# EAGLE design FrontSensor_PCB_v5 (EAGLE 9.7.0)
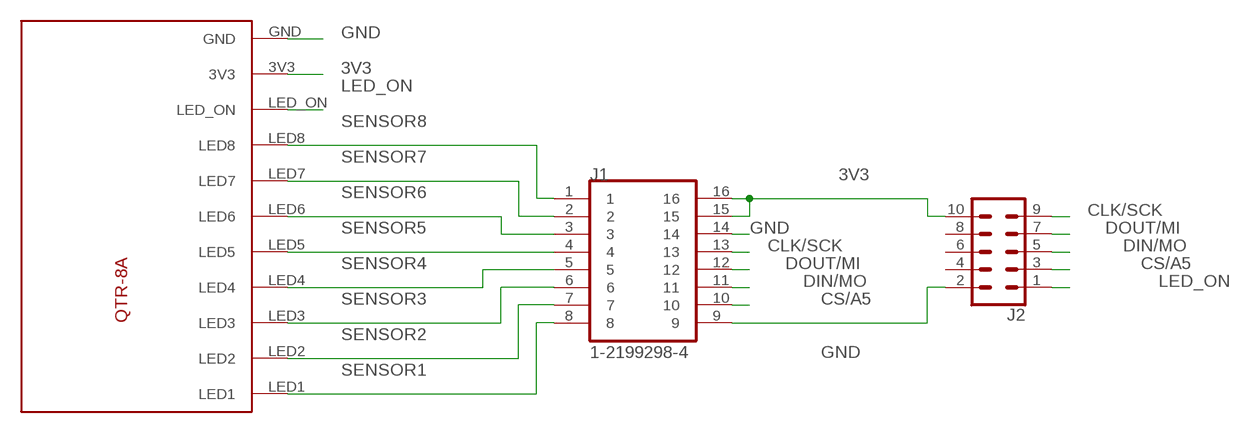
[diagram p0: schematic, sheet 1]

## Parts
J1  1-2199298-4  [TE_1-2199298-4]
J2  CONN_05X2SHD  [2X5-SHROUDED]
U$1  QTR-8A  [QTR-8A]

## Nets
3V3: J1.15 J1.16 J2.10 U$1.3V3
CLK/SCK: J1.13 J2.9
CS/A5: J1.10 J2.3
DIN/MO: J1.11 J2.5
DOUT/MI: J1.12 J2.7
GND: J1.9 J1.14 J2.2 U$1.GND
LED_ON: J2.1 U$1.LED_ON
SENSOR1: J1.8 U$1.LED1
SENSOR2: J1.7 U$1.LED2
SENSOR3: J1.6 U$1.LED3
SENSOR4: J1.5 U$1.LED4
SENSOR5: J1.4 U$1.LED5
SENSOR6: J1.3 U$1.LED6
SENSOR7: J1.2 U$1.LED7
SENSOR8: J1.1 U$1.LED8
Unconnected: J2.4 J2.6 J2.8

## Library data of the parts
J1 = 16 pin IC Socket:1-2199298-4; MANUFACTURER: TE; PARTREV: A; STANDARD: Manufacturer Recommendations
J2 = SparkFun-Connectors:CONN_05X2: Multi connection point. Often used as Generic Header-pin footprint for 0.1 inch spaced/style header connections For AVR SPI programming port, see special device with nice symbol: "AVR_SPI_PROG_5x2.dev" You can populate with any combo of single row headers, but if you'd like an exact match, check these: 2x5 AVR ICSP Male Header <https://www.sparkfun.com/products/778> (PRT-00778) 2x5 Pin Shrouded Header <https://www.sparkfun.com/products/8506> (PRT-08506) On any of the 0.1 inch spaced packages, you can populate with these: Break Away Headers - Straight <https://www.sparkfun.com/products/116> (PRT-00116) Break Away Male Headers - Right Angle <https://www.sparkfun.com/products/553> (PRT-00553) Female Headers <https://www.sparkfun.com/products/115> (PRT-00115) Break Away Headers - Machine Pin <https://www.sparkfun.com/products/117> (PRT-00117) Break Away Female Headers - Swiss Machine Pin <https://www.sparkfun.com/products/743> (PRT-00743) Special note: the shrouded connector mates well with our 5x2 ribbon cables: 2x5 Pin IDC Ribbon Cable <https://www.sparkfun.com/products/8535> (PRT-08535); PROD_ID: CONN-08671; SF_ID: PRT-08506
U$1 = QTR-8A:QTR-8A: Check availability <https://pricing.snapeda.com/parts/QTR-8A/Pololu/view-part?ref=eda>; AVAILABILITY: Not in stock; CHECK_PRICES: https://www.snapeda.com/parts/QTR-8A/Pololu/view-part/?ref=eda; DESCRIPTION: QRE1113GR series Phototransistor Sensor Evaluation Board; MF: Pololu; MP: QTR-8A; PACKAGE: None; PRICE: None; SNAPEDA_LINK: https://www.snapeda.com/parts/QTR-8A/Pololu/view-part/?ref=snap

## Board
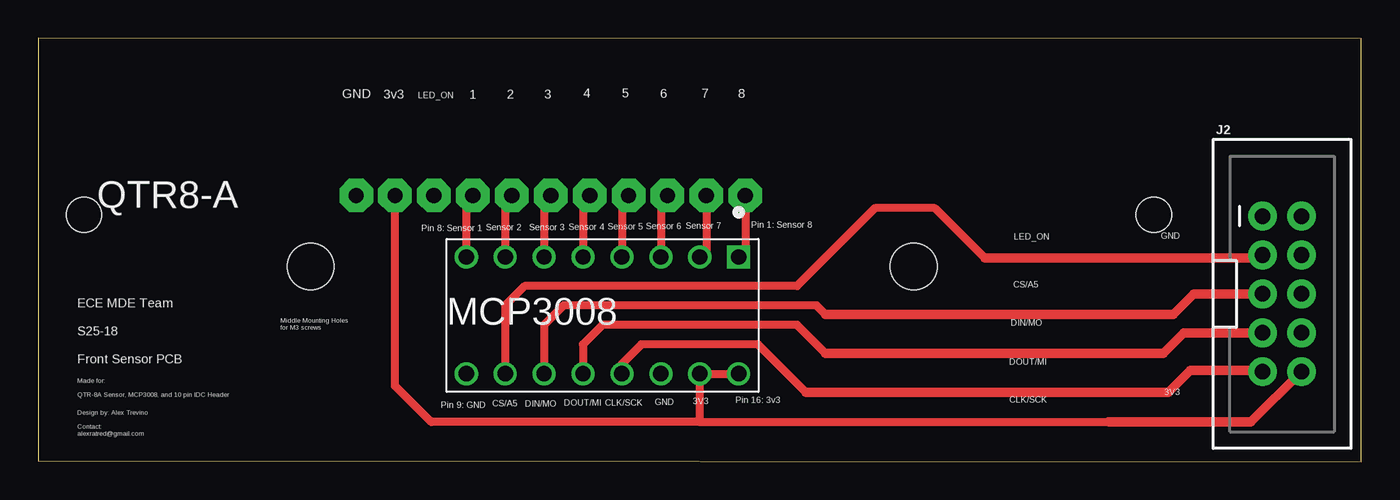
[diagram p1: board, top side]
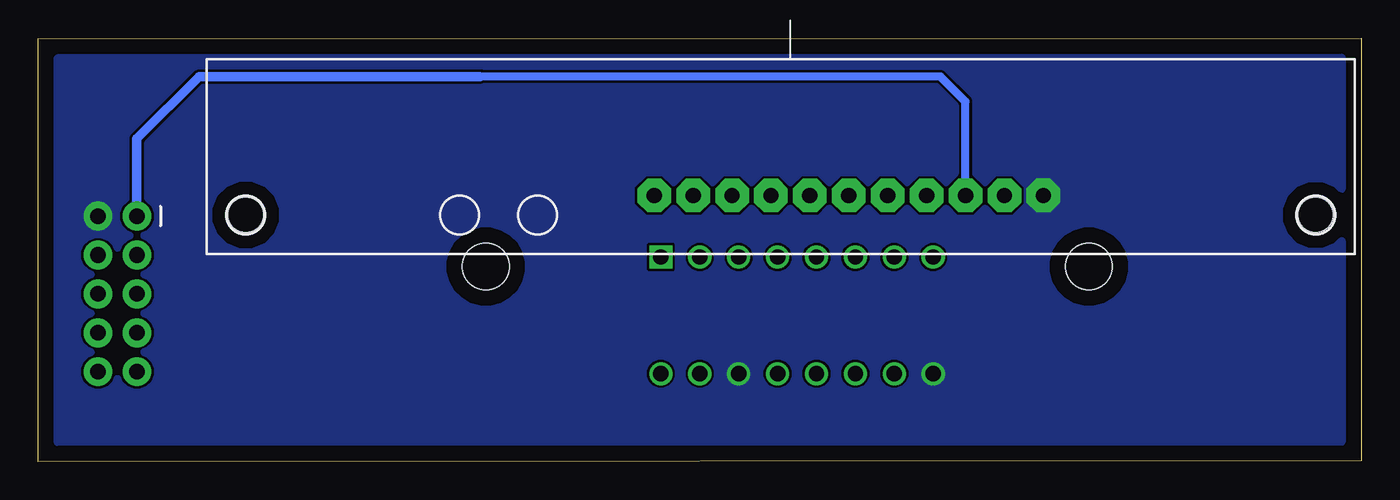
[diagram p2: board, bottom side, seen from below]

Size 86.36 x 27.65 mm. Coordinates in mm from the lower left corner, seen from the top.
Outline: 0,0.04 86.36,0 86.36,27.61 0,27.65 0,0.04
Copper layers (1*16): Top / Bottom
Stack-up Default Layer Stack: Top User Defined 0.035mm / Dielectric-1 User Defined 1.5mm / Bottom User Defined 0.035mm
Design rules: minimum copper width 6mil, minimum drill size 0.35mm, copper clearance wire_polygon to wire_polygon 6mil, copper clearance wire_polygon to pad_smd 6mil, copper clearance wire_polygon to via 6mil, copper clearance pad_smd to pad_smd 6mil, copper clearance pad_smd to via 6mil, copper clearance via to via 6mil, copper clearance smd to pad (same net) 6mil, copper clearance smd to via (same net) 6mil, copper clearance smd to smd (same net) 6mil, dimension clearance 40mil, via restrict clearance 0mil, restrict clearance 0mil, drill distance 6mil, keepout clearance 0mil
Holes 3.05 mm at 57.15,12.74 17.78,12.74

### Footprints (pad centres in the part's own frame; a part is rotated, then mirrored left to right if it is on the bottom)
TE_1-2199298-4 = drill 1 square: 1 -3.81,8.89 | drill 1: 2 -3.81,6.35; 3 -3.81,3.81; 4 -3.81,1.27; 5 -3.81,-1.27; 6 -3.81,-3.81; 7 -3.81,-6.35; 8 -3.81,-8.89; 9 3.81,-8.89; 10 3.81,-6.35; 11 3.81,-3.81; 12 3.81,-1.27; 13 3.81,1.27; 14 3.81,3.81; 15 3.81,6.35; 16 3.81,8.89
2X5-SHROUDED = drill 1.016 pad 1.88: 1 -1.27,5.08; 2 1.27,5.08; 3 -1.27,2.54; 4 1.27,2.54; 5 -1.27,0; 6 1.27,0; 7 -1.27,-2.54; 8 1.27,-2.54; 9 -1.27,-5.08; 10 1.27,-5.08
QTR-8A = drill 1 pad 2.184 octagon: 3V3 -30.48,-1.27; GND -33.02,-1.27; LED1 -25.4,-1.27; LED2 -22.86,-1.27; LED3 -20.32,-1.27; LED4 -17.78,-1.27; LED5 -15.24,-1.27; LED6 -12.7,-1.27; LED7 -10.16,-1.27; LED8 -7.62,-1.27; LED_ON -27.94,-1.27 | hole 2.286: -50.8,0; 19.05,0

### Placement (x,y rotation side)
J1  36.83,9.55 270 top
J2  81.19,10.95 0 top
U$1  53.77,16.11 180 bottom

### Tracks (layer width: path | path; a pad name or v marks a point on that pad's centre or on a via)
3V3
  Top 0.508: 43.18,2.58 69.85,2.58 | 43.18,2.58 J1.15 J1.16 | 43.18,2.58 25.65,2.58 23.29,4.94 U$1.3V3
  Top 0.61: 69.85,2.58 79.17,2.58 J2.10
CLK/SCK
  Top 0.508: 50.11,4.54 46.99,7.66 39.37,7.66 38.1,6.39 J1.13
  Top 0.61: 50.11,4.54 73.78,4.54 75.21,5.96 79.83,5.96 J2.9
CS/A5
  Top 0.508: 61.79,13.3 58.54,16.55 54.61,16.55 49.53,11.47 31.75,11.47 30.48,10.2 J1.10
  Top 0.61: 61.79,13.3 79.73,13.3 J2.3
DIN/MO
  Top 0.508: 51.38,9.62 50.8,10.2 34.29,10.2 33.02,8.93 J1.11
  Top 0.61: 51.38,9.62 74.09,9.62 75.43,10.95 J2.5
DOUT/MI
  Top 0.508: 51.38,7.08 49.53,8.93 36.83,8.93 35.56,7.66 J1.12
  Top 0.61: 51.38,7.08 73.46,7.08 74.8,8.41 J2.7
GND
  pour Bottom (no thermals): 0,27.98 86.91,27.98 86.91,0.04 0,0.04
LED_ON
  Bottom 0.508: 57.53,25.16 27.46,25.16 25.83,23.52 U$1.LED_ON
  Bottom 0.61: 57.53,25.16 75.87,25.16 79.92,21.1 J2.1
SENSOR1
  Top 0.508: U$1.LED1 27.94,16.95 J1.8
SENSOR2
  Top 0.508: U$1.LED2 30.48,16.95 J1.7
SENSOR3
  Top 0.508: U$1.LED3 33.02,16.95 J1.6
SENSOR4
  Top 0.508: U$1.LED4 35.56,16.95 J1.5
SENSOR5
  Top 0.508: U$1.LED5 38.1,16.95 J1.4
SENSOR6
  Top 0.508: U$1.LED6 40.64,16.95 J1.3
SENSOR7
  Top 0.508: U$1.LED7 43.61,13.79 J1.2
SENSOR8
  Top 0.508: U$1.LED8 46.15,13.79 J1.1

### Text on the board
SilkscreenTop: GND | 3v3 | LED_ON | 1 | 2 | 3 | 4 | 5 | 6 | 7 | 8 | QTR8-A | Pin 8: Sensor 1 | Sensor 2 | Sensor 3 | Sensor 4 | Sensor 5 | Sensor 6 | Sensor 7 | Pin 1: Sensor 8 | LED_ON | GND | CS/A5 | MCP3008 | Middle Mounting Holes / for M3 screws | DIN/MO | ECE MDE Team / / S25-18 / / Front Sensor PCB | DOUT/MI | Made for: / / QTR-8A Sensor, MCP3008, and 10 pin IDC Header | 3V3 | Pin 9: GND | CS/A5 | DIN/MO | DOUT/MI | CLK/SCK | GND | 3V3 | Pin 16: 3v3 | CLK/SCK | Design by: Alex Trevino / / Contact: / alexratred@gmail.com